# EasyEDA Pro project Full Wave Bridge Rectifier.eprj

# Schematic Schematic1
Create Date: 2023-09-16; Page Name: P1; Project Name: Full Wave Bridge Rectifier; Schematic Name: Schematic1; Update Date: 2023-09-16; Company: Joshua Ifeanyi Okonkwo; Drawed: EasyEDA Pro; Page Size: A4; Part Number: JLCPCB-002; Reviewed: EasyEDA Pro; Version: V0.1
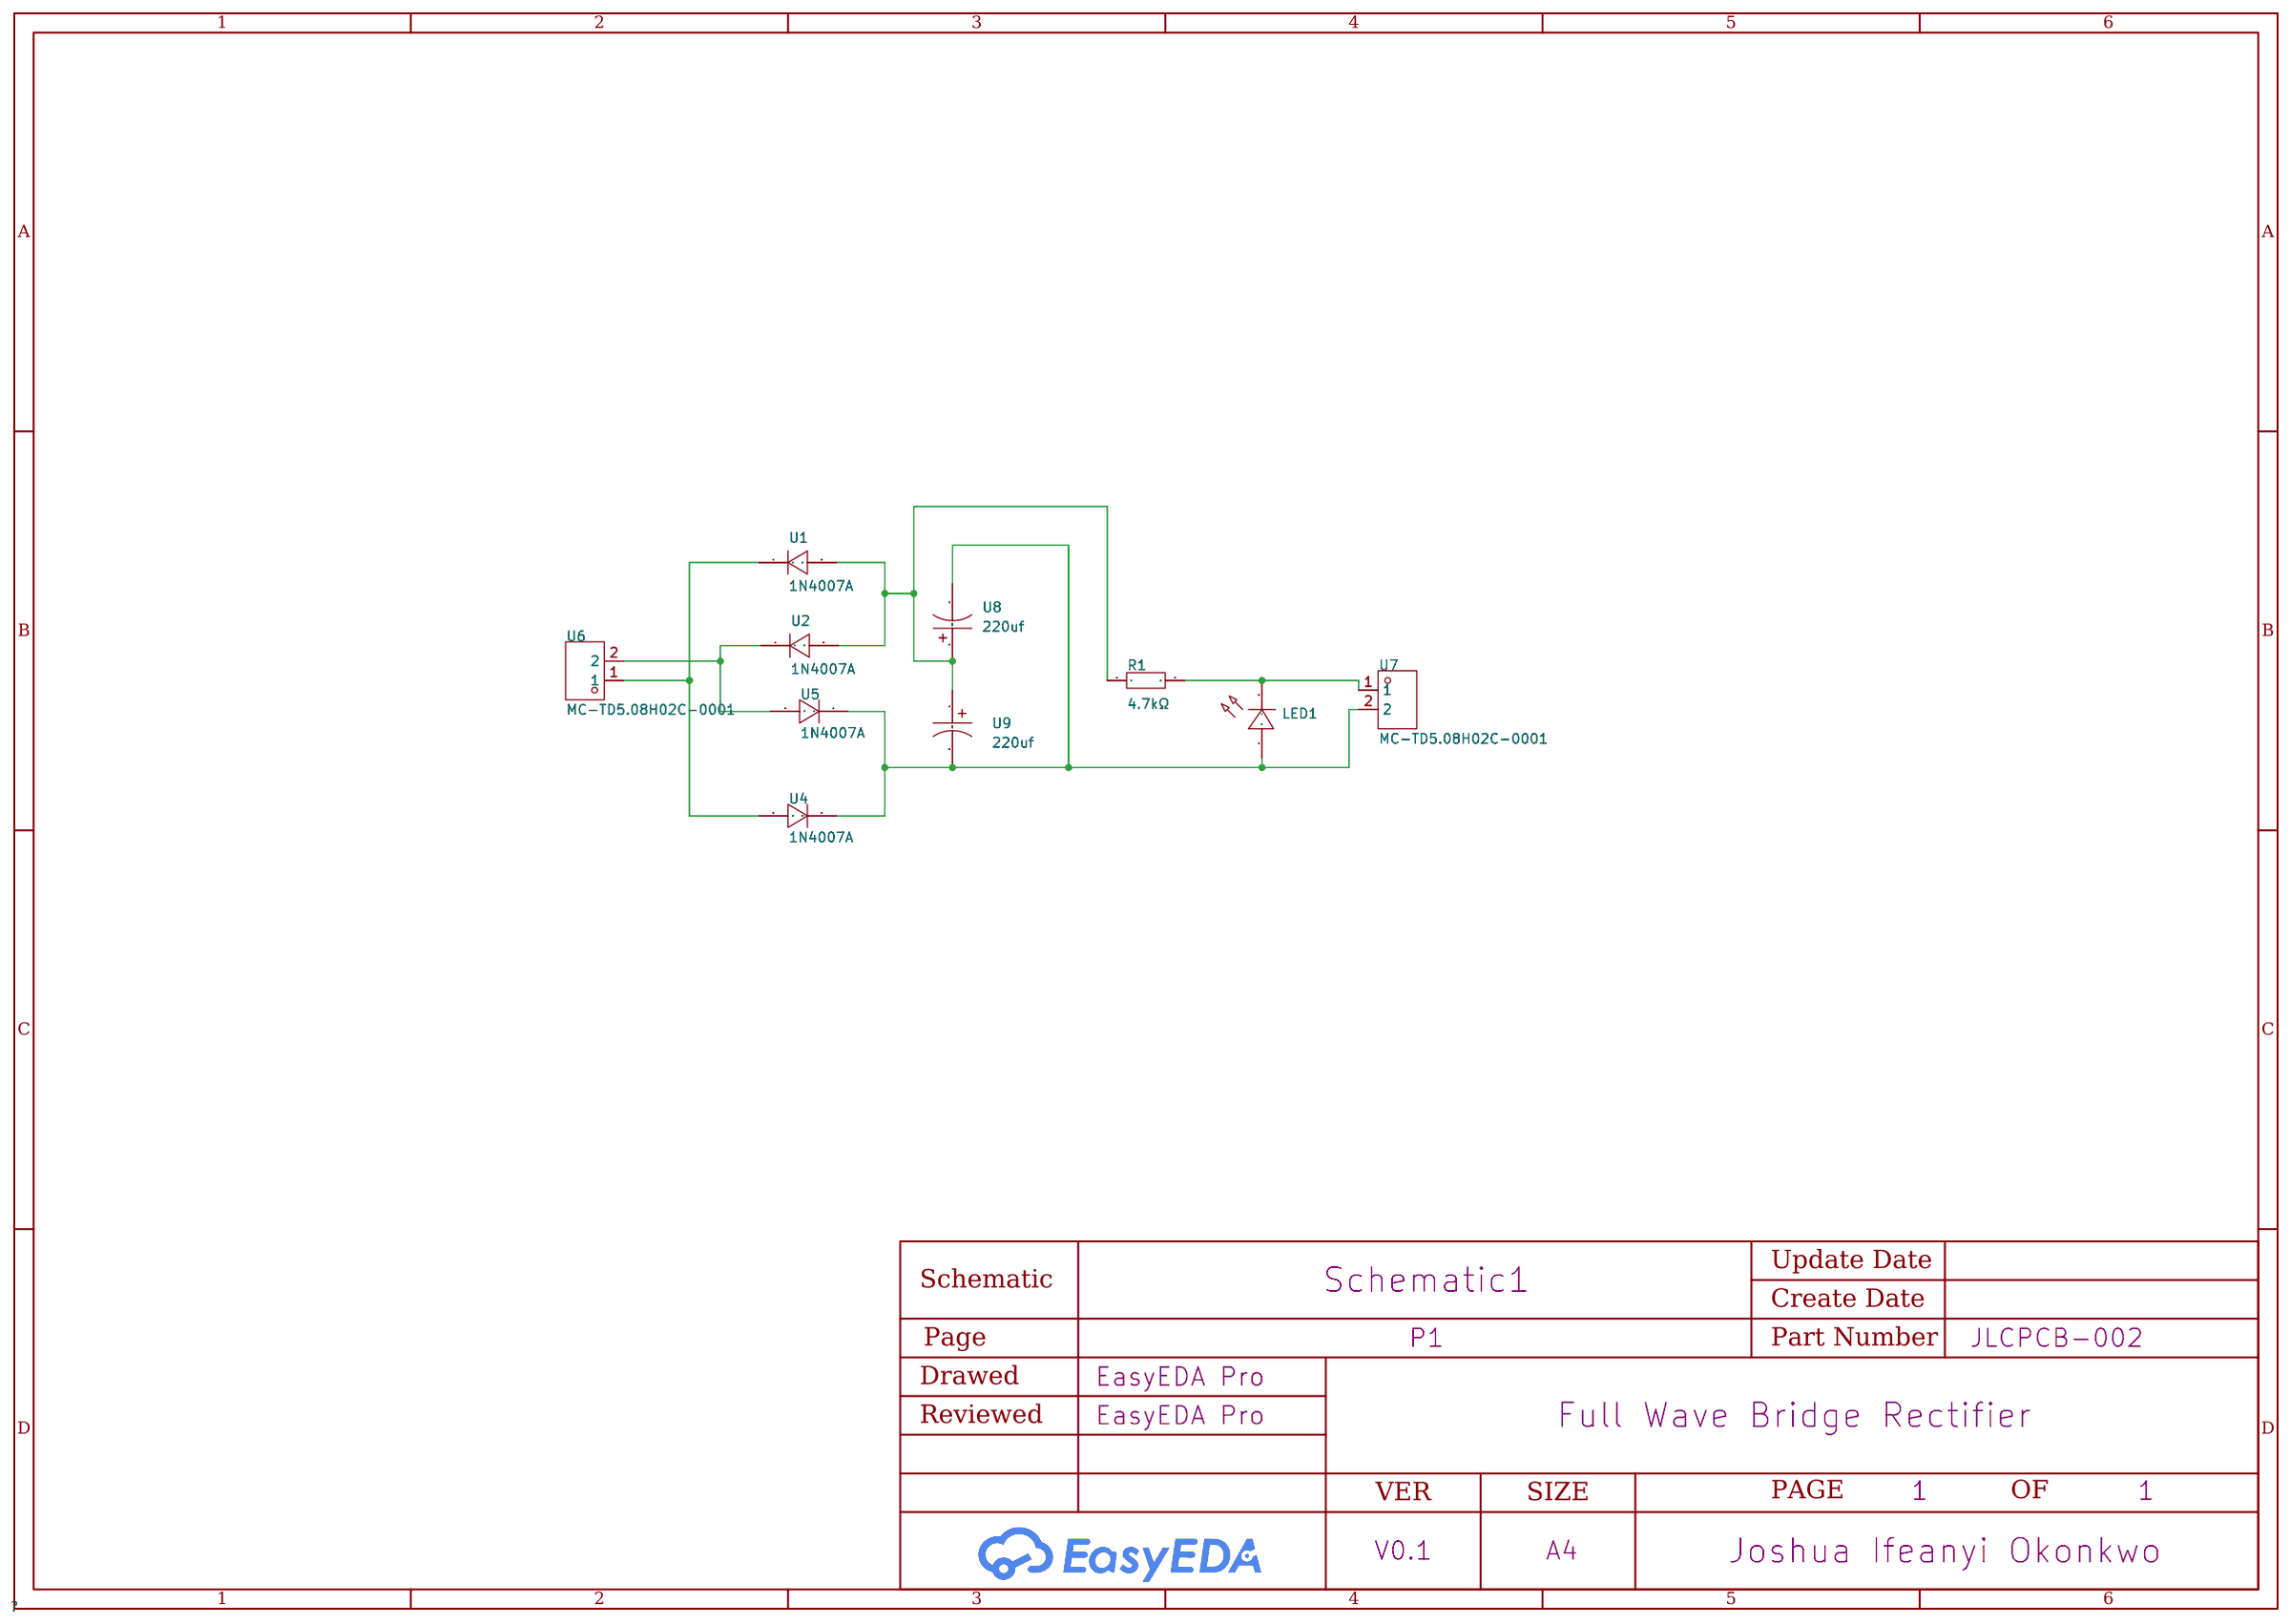
[diagram p0: schematic sheet]

## Parts
LED1  -  [LED-TH_BD3.0-P2.54-FD]
R1  4.7kΩ  [RES-TH_BD1.8-L3.2-P7.20-D0.4]
U1  1N4007A  [DO-41_BD2.4-L4.7-P8.70-D0.9-RD]
U2  1N4007A  [DO-41_BD2.4-L4.7-P8.70-D0.9-RD]
U4  1N4007A  [DO-41_BD2.4-L4.7-P8.70-D0.9-RD]
U5  1N4007A  [DO-41_BD2.4-L4.7-P8.70-D0.9-RD]
U6  MC-TD5.08H02C-0001  [CONN-TH_MC-TD5.08H02C-0001]
U7  MC-TD5.08H02C-0001  [CONN-TH_MC-TD5.08H02C-0001]
U8  220uf  [CAP-TH_BD8.0-P3.50-D0.6-FD]
U9  220uf  [CAP-TH_BD8.0-P3.50-D0.6-FD]

## Library data of the parts
LED1 = LED_TH-R_3mm: Supplier Footprint: Through
R1 = Res_AXIAL-1/8W: Supplier Footprint: Through
U1 U2 U4 U5 = 1N4007A: Supplier Part: C5336145; Manufacturer: LRC(乐山无线电); Supplier Footprint: DO-41; Supplier: LCSC
U6 U7 = MC-TD5.08H02C-0001: Pitch:5.08mm Number of Rows:1 Number of PINs Per Row:2 Mounting Style:直针 Current Rating (Max):24A Voltage Rating (Max):400V Wire Gauge - AWG:- Wire Gauge - mm?:- Operating Temperature Range:-40℃~+105℃ Operating Temperature Range:-40℃~+105℃ Color:Green; LCSC Part Name: 5.08mm 排数:1 每排P数:2 直针; Supplier Part: C2839417; Manufacturer: SUPU(速普); Supplier Footprint: 直插,P=5.08mm; JLCPCB Part Class: Extended Part; Datasheet: https://atta.szlcsc.com/upload/public/pdf/source/20210702/C2839417_586129341A20CEBE5A96A727881A68F0.pdf; Supplier: LCSC; Pitch: 5.08mm; Number of Rows: 1; Number of PINs Per Row: 2; Mounting Style: 直针; Current Rating (Max): 24A; Voltage Rating (Max): 400V; Operating Temperature Range: -40℃~+105℃; Color: Green
U8 U9 = Capacitor_THT:CP_Radial_D8.0mm_P2.50mm: Supplier Part: C9900016268; Supplier Footprint: 470uF_25V; JLCPCB Part Class: Extended Part; Datasheet: https://atta.szlcsc.comnull; Supplier: LCSC

## Nets
$1N527: U1.1 U4.2 U6.1
$1N528: U2.1 U5.2 U6.2
$1N742: LED1.1(C) U4.1 U5.1 U7.2 U8.2 U9.2
$1N777: R1.1 U1.2 U2.2 U8.1 U9.1
$1N797: LED1.2(A) R1.2 U7.1

# Board PCB1
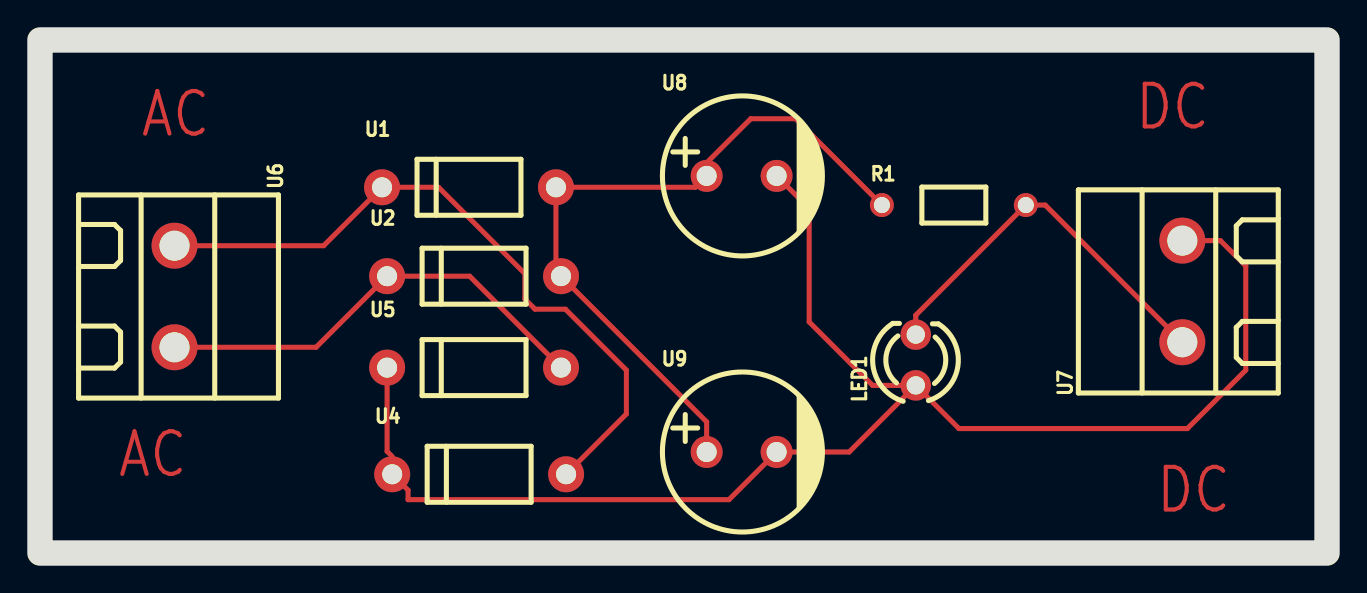
[diagram p1: board, top side]
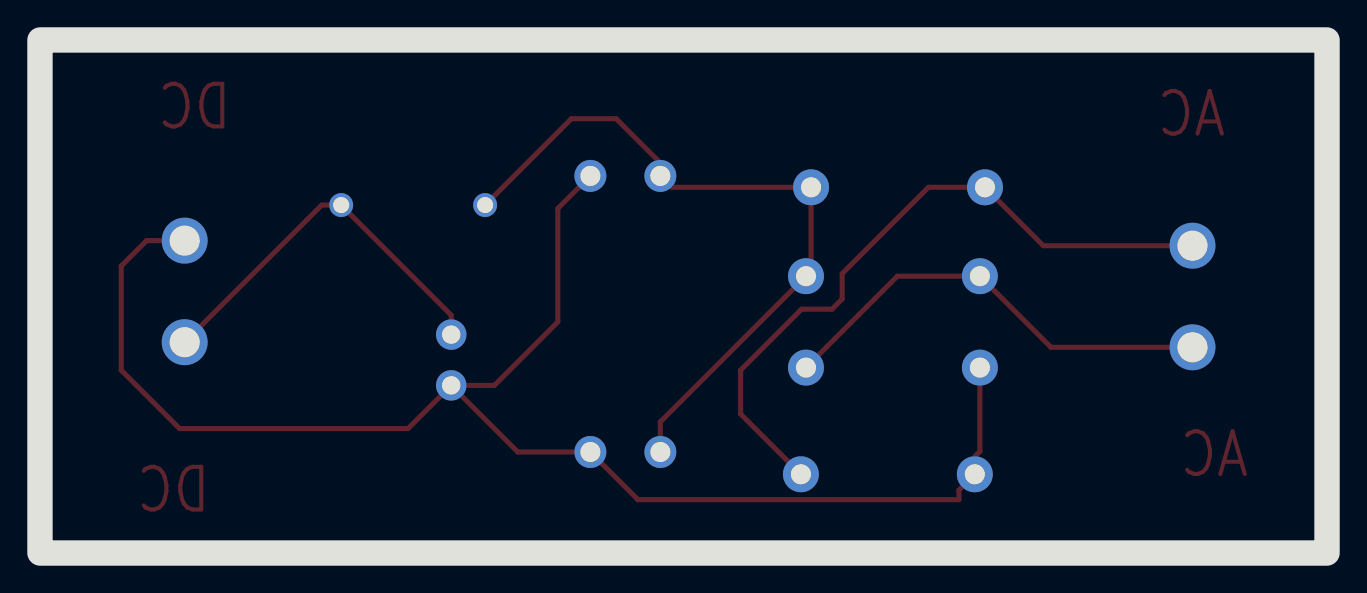
[diagram p2: board, bottom side, seen from below]

Outline 64.39 x 25.65 mm; copper layers: Top Layer, Bottom Layer. Coordinates in mm from the lower left corner of the outline.
Outline path: rectangle 0,25.65 64.39,0
Stack: Top Layer 0.035mm / Dielectric1 1.51mm FR4 er 4.5 / Bottom Layer 0.035mm

## Design rules (mm)
template: JLCPCB Capability(Two Layers Board)
spacing copperThickness1oz (default): track to track 0.102, other pairs 0.152 to 0.3
spacing copperThickness2oz: track to track 0.203, other pairs 0.152 to 0.3
track width copperThickness1oz (default): min 0.127, default 0.254, max 2.54
track width copperThickness2oz: min 0.203, default 0.254, max 2.54
differential pair differentialPair (default): width min 0.127, default 0.254, max 2.54; gap min 0.152, default 0.152
via viaSize (default): diameter min 0.5, default 0.61, max 10; hole min 0.3, default 0.305, max 6.3

## Placement (name value [footprint] x y rotation side)
LED1  -  [LED-TH_BD3.0-P2.54-FD]  43.82 9.65 90 top
R1  4.7kΩ  [RES-TH_BD1.8-L3.2-P7.20-D0.4]  45.72 17.4 0 top
U1  1N4007A  [DO-41_BD2.4-L4.7-P8.70-D0.9-RD]  21.46 18.29 0 top
U2  1N4007A  [DO-41_BD2.4-L4.7-P8.70-D0.9-RD]  21.72 13.84 0 top
U4  1N4007A  [DO-41_BD2.4-L4.7-P8.70-D0.9-RD]  21.97 3.94 0 top
U5  1N4007A  [DO-41_BD2.4-L4.7-P8.70-D0.9-RD]  21.72 9.27 0 top
U6  MC-TD5.08H02C-0001  [CONN-TH_MC-TD5.08H02C-0001]  6.73 12.83 270 top
U7  MC-TD5.08H02C-0001  [CONN-TH_MC-TD5.08H02C-0001]  57.15 13.08 90 top
U8  220uf  [CAP-TH_BD8.0-P3.50-D0.6-FD]  35.1 18.86 0 top
U9  220uf  [CAP-TH_BD8.0-P3.50-D0.6-FD]  35.1 5.05 0 top

## Footprints (pads in the part's own frame, mm; a bottom-side part is the same pattern mirrored in y, then rotated)
CAP-TH_BD8.0-P3.50-D0.6-FD
  round 1.6 hole 1: 1(-1.75,0) 2(1.75,0)
CONN-TH_MC-TD5.08H02C-0001
  round 2.3 hole 1.5: 1(-2.54,0) 2(2.54,0)
DO-41_BD2.4-L4.7-P8.70-D0.9-RD
  round 1.8 hole 1: 1(-4.35,0) 2(4.35,0)
LED-TH_BD3.0-P2.54-FD
  round 1.524 hole 0.914: 1(-1.27,0) 2(1.27,0)
RES-TH_BD1.8-L3.2-P7.20-D0.4
  round 1.2 hole 0.8: 1(-3.6,0) 2(3.6,0)

## Nets
As in the schematic.

## Routing (per net, layer and track width the routed paths; a pad name or vN(x,y) marks a point on that pad's centre or on a via; arc(x,y) is an arc through that point)
$1N527: length 34.8
  Top Layer w0.254: U6.1 14.19,15.37 U1.1 19.94,18.29 24.26,13.97 24.26,12.7 24.77,12.19 26.29,12.19 29.34,9.14 29.34,6.95 U4.2
$1N528: length 22.7
  Top Layer w0.254: U5.2 21.5,13.84 U2.1 13.81,10.29 U6.2
$1N742: length 76.1
  Top Layer w0.254: U8.2 38.48,17.23 38.48,11.56 41.66,8.38 LED1.1 ; 17.62,3.94 18.42,3.14 18.42,2.67 34.47,2.67 U9.2 40.48,5.05 LED1.1 ; U5.1 17.37,5.08 17.62,4.83 ; LED1.1 45.97,6.22 57.4,6.22 60.33,9.14 60.33,14.35 59.05,15.62 U7.2
$1N777: length 36.3
  Top Layer w0.254: R1.1 37.8,21.72 35.56,21.72 33.35,19.51 U8.1 32.78,18.29 U1.2 25.81,14.1 U2.2 33.35,6.56 U9.1
$1N797: length 19.4
  Top Layer w0.254: U7.1 50.29,17.4 R1.2 43.82,11.89 LED1.2

## Text on the board
Top Layer: AC | DC
